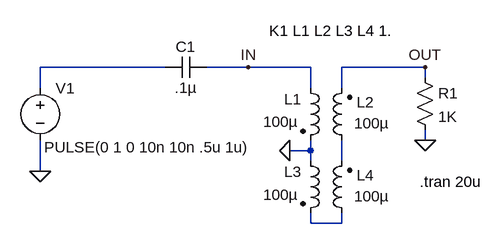
[diagram p0: schematic xformer4.asc]
xformer4.asc, the LTspice schematic file:
Version 4
SHEET 1 880 680
WIRE -384 224 -384 192
WIRE -384 352 -384 304
WIRE -192 192 -384 192
WIRE -64 192 -128 192
WIRE 32 192 -64 192
WIRE 32 224 32 192
WIRE 32 320 0 320
WIRE 32 320 32 304
WIRE 32 336 32 320
WIRE 32 432 32 416
WIRE 80 224 80 192
WIRE 80 336 80 304
WIRE 80 432 32 432
WIRE 80 432 80 416
WIRE 208 192 80 192
WIRE 208 208 208 192
WIRE 208 304 208 288
FLAG -384 352 0
FLAG 208 304 0
FLAG 208 192 OUT
FLAG -64 192 IN
FLAG 0 320 0
SYMBOL ind2 16 208 R0
WINDOW 0 2 33 Right 0
WINDOW 3 -3 68 Right 0
SYMATTR InstName L1
SYMATTR Value 100µ
SYMATTR Type ind
SYMBOL ind2 96 320 R180
WINDOW 0 -7 74 Right 0
WINDOW 3 -3 42 Right 0
SYMATTR InstName L2
SYMATTR Value 100µ
SYMATTR Type ind
SYMBOL voltage -384 208 R0
WINDOW 3 6 107 Left 0
SYMATTR Value PULSE(0 1 0 10n 10n .5u 1u)
SYMATTR InstName V1
SYMBOL res 192 192 R0
SYMATTR InstName R1
SYMATTR Value 1K
SYMBOL cap -128 176 R90
WINDOW 0 0 32 VBottom 0
WINDOW 3 32 32 VTop 0
SYMATTR InstName C1
SYMATTR Value .1µ
SYMBOL ind2 16 320 R0
WINDOW 0 2 33 Right 0
WINDOW 3 -3 68 Right 0
SYMATTR InstName L3
SYMATTR Value 100µ
SYMATTR Type ind
SYMBOL ind2 96 432 R180
WINDOW 0 -7 74 Right 0
WINDOW 3 -3 42 Right 0
SYMATTR InstName L4
SYMATTR Value 100µ
SYMATTR Type ind
TEXT 200 368 Left 0 !.tran 20u
TEXT -32 136 Left 0 !K1 L1 L2 L3 L4 1.

The netlist it stands for:
* xformer4.asc
L1 IN 0 100µ
L2 N003 OUT 100µ
V1 N001 0 PULSE(0 1 0 10n 10n .5u 1u)
R1 OUT 0 1K
C1 IN N001 .1µ
L3 0 N002 100µ
L4 N002 N003 100µ
.tran 20u
K1 L1 L2 L3 L4 1.
.backanno
.end